# EAGLE design thermo_test (EAGLE 9.6.2)
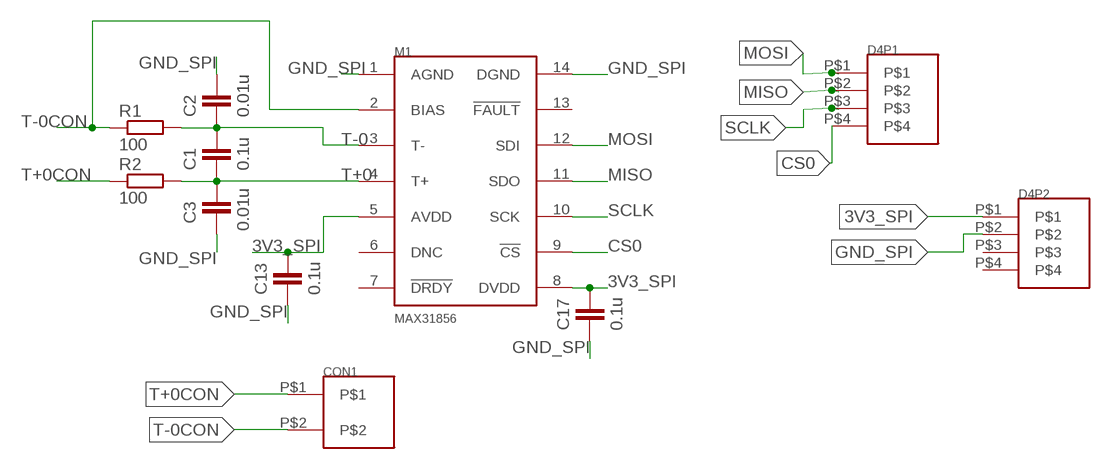
[diagram p0: schematic, sheet 1]

## Parts
C1  0.1u  C-EUC0603  [C0603]
C2  0.01u  C-EUC0603  [C0603]
C3  0.01u  C-EUC0603  [C0603]
C13  0.1u  C-EUC0603  [C0603]
C17  0.1u  C-EUC0603  [C0603]
CON1  893-1332  [893-1332]
D4P1  DF1E-4P  [DF1E-4P]
D4P2  DF1E-4P  [DF1E-4P]
M1  MAX31856  [TSSOP14]
R1  100  R-EU_R0603  [R0603]
R2  100  R-EU_R0603  [R0603]

## Nets
3V3_SPI [dev]: C13.1 C17.1 D4P2.P$1 M1.5(AVDD) M1.8(DVDD)
CS0 [dev]: D4P1.P$4 M1.9(!CS)
GND_SPI [dev]: C2.1 C3.2 C13.2 C17.2 D4P2.P$2 M1.1(AGND) M1.14(DGND)
MISO [spi_bus]: D4P1.P$2 M1.11(SDO)
MOSI [spi_bus]: D4P1.P$1 M1.12(SDI)
SCLK [spi_bus]: D4P1.P$3 M1.10(SCK)
T+0 [tc]: C1.2 C3.1 M1.4(T+) R2.2
T+0CON [tc]: CON1.P$1 R2.1
T-0 [tc]: C1.1 C2.2 M1.3(T-) R1.2
T-0CON [tc]: CON1.P$2 M1.2(BIAS) R1.1
Unconnected: D4P2.P$3 D4P2.P$4 M1.6(DNC) M1.7(!DRDY) M1.13(!FAULT)

## Library data of the parts
C1-C3 C13 C17 = rcl:C-EU: CAPACITOR, European symbol; SPICEPREFIX: C
CON1 = lib_test:893-1332
D4P1 D4P2 = lib_test:DF1E-4P
M1 = lib_test:MAX31856
R1 R2 = rcl:R-EU_: RESISTOR, European symbol; SPICEPREFIX: R

## Net classes
0 default: width 0.254 mm, drill 0.305 mm, clearance 0.254 mm
1 spi_bus: width 0.254 mm, drill 0.305 mm, clearance 0.254 mm
2 spi_cs: width 0.254 mm, drill 0.305 mm, clearance 0.254 mm
3 tc: width 0.254 mm, drill 0.305 mm, clearance 0.254 mm
4 3v3: width 0.508 mm, drill 0.61 mm, clearance 0.508 mm
5 gnd: width 0.762 mm, drill 0.889 mm, clearance 0.254 mm
6 dev: width 0.254 mm, drill 0.254 mm, clearance 0.254 mm

## Board
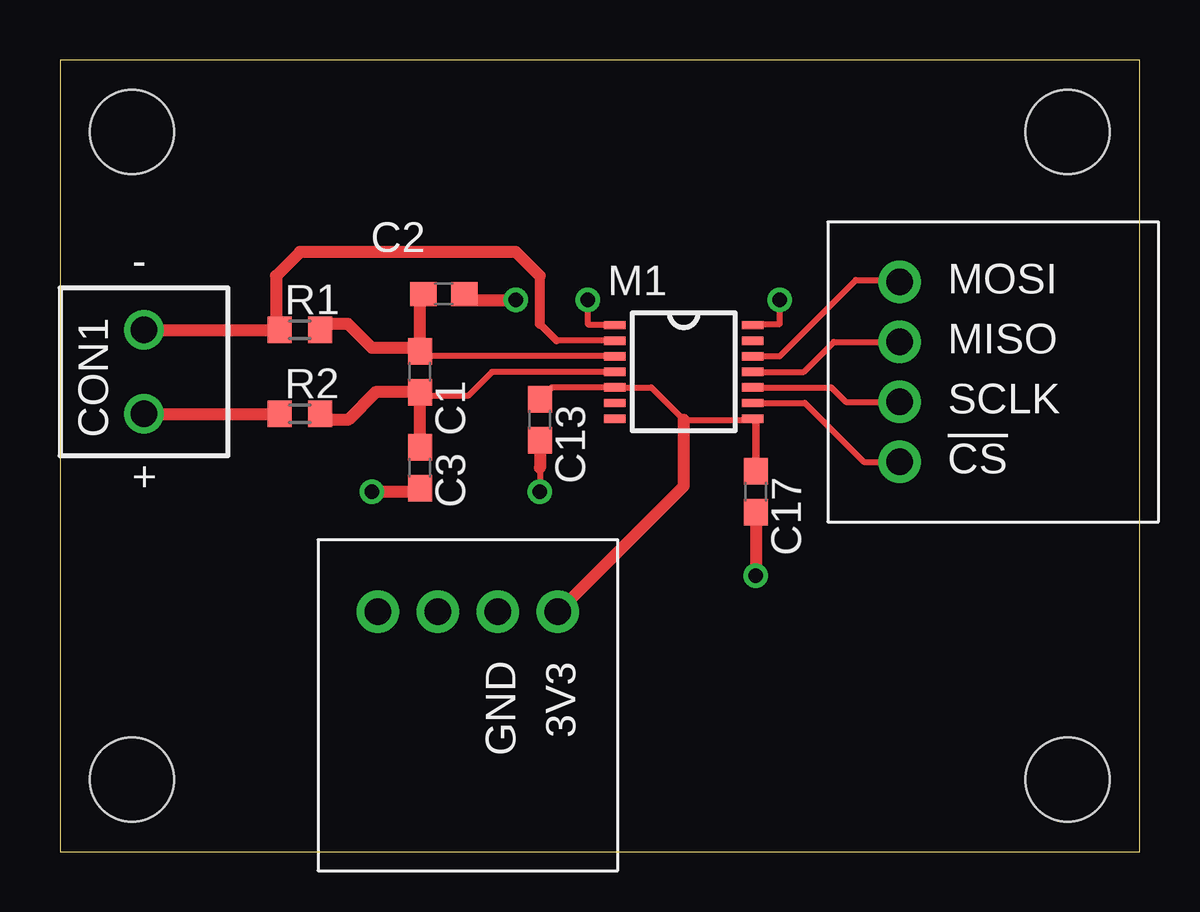
[diagram p1: board, top side]
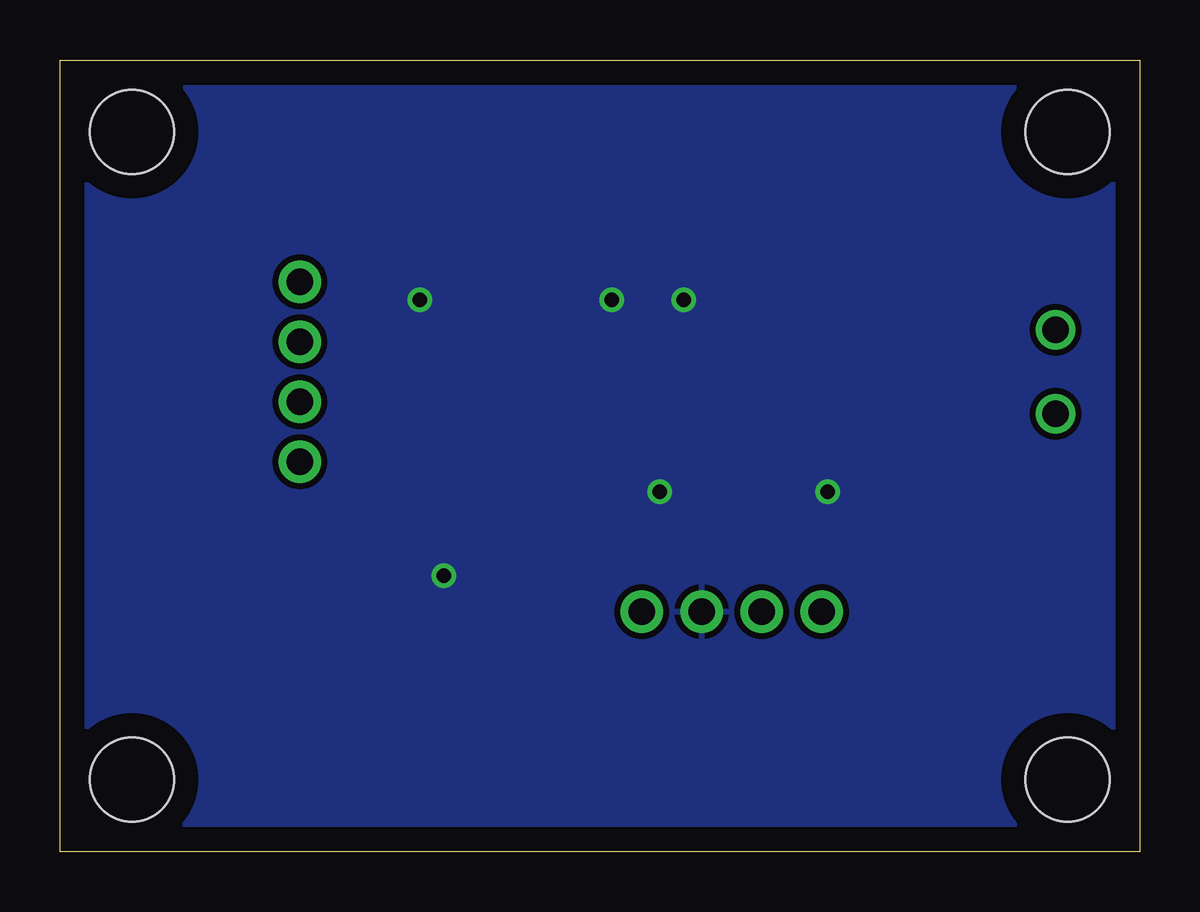
[diagram p2: board, bottom side, seen from below]

Size 45 x 33 mm. Coordinates in mm from the lower left corner, seen from the top.
Outline: 0,0 45,0 45,33 0,33 0,0
Copper layers (1*16): Top 0.035mm / dielectric 1.5mm / Bottom 0.035mm
Design rules "default": minimum track width 6mil, minimum drill 0.35mm, track to track 6mil, track to pad 6mil, pad to pad 6mil, via to via 6mil, smd to smd 6mil, copper to edge 40mil, drill to drill 6mil, minimum pad ring 10mil, minimum via ring 8mil, stop-mask expansion 4mil, vias tented up to drill 0mil, thermal gap 10mil
Holes 3.5 mm at 3,3 42,3 3,30 42,30

### Footprints (pad centres in the part's own frame; a part is rotated, then mirrored left to right if it is on the bottom)
C0603 = smd 1.1 x 1: 1 -0.85,0; 2 0.85,0
893-1332 = drill 1.1: P$1 0,1.75; P$2 0,-1.75
DF1E-4P = drill 1.1 pad 1.778: P$1 0,3.75; P$2 0,1.25; P$3 0,-1.25; P$4 0,-3.75
TSSOP14 = smd 0.9 x 0.35: 1 -2.875,1.95; 2 -2.875,1.3; 3 -2.875,0.65; 4 -2.875,0; 5 -2.875,-0.65; 6 -2.875,-1.3; 7 -2.875,-1.95; 8 2.875,-1.95; 9 2.875,-1.3; 10 2.875,-0.65; 11 2.875,0; 12 2.875,0.65; 13 2.875,1.3; 14 2.875,1.95
R0603 = smd 1 x 1.1: 1 -0.85,0; 2 0.85,0

### Placement (x,y rotation side)
C1  15,20 270 top
C2  16,23.25 180 top
C3  15,16 270 top
C13  20,18 270 top
C17  29,15 270 top
CON1  3.5,20 180 top
D4P1  35,20 0 top
D4P2  17,10 270 top
M1  26,20 0 top
R1  10,21.75 0 top
R2  10,18.25 0 top

### Tracks (layer width: path | path; a pad name or v marks a point on that pad's centre or on a via)
3V3_SPI
  Top 0.254: M1.8 28.82,18 26,18 24.65,19.35 M1.5 20.5,19.35 C13.1
  Top 0.305: M1.8 29,17.93 C17.1
  Top 0.508: D4P2.P$1 26,15.25 26,18
CS0
  Top 0.254: M1.9 31.05,18.7 33.5,16.25 D4P1.P$4
GND_SPI  (via drill 0.61)
  Top 0.254: 20,16 v20,15 | M1.1 22.05,21.95 22,22 v22,23 | M1.14 28.93,22 30,22 v30,23
  Top 0.508: C13.2 20,16 | C17.2 v29,11.5 | C2.1 17.1,23 v19,23 | C3.2 14.85,15 v13,15
  pour Bottom: 0,33 0,0 45,0 45,33
MISO
  Top 0.254: M1.11 31,20 32.25,21.25 D4P1.P$2
MOSI
  Top 0.254: M1.12 30,20.65 33.17,23.82 34.92,23.82 D4P1.P$1
SCLK
  Top 0.254: M1.10 32.15,19.35 32.75,18.75 D4P1.P$3
T+0
  Top 0.254: M1.4 18,20 17,19 15.15,19 | 15.15,19 C1.2 | 11.1,18 R2.2 | 15,18.85 15.15,19
  Top 0.508: C1.2 13.15,19.15 12,18 11.1,18 | C3.1 15,18.85
T+0CON
  Top 0.508: CON1.P$1 R2.1
T-0
  Top 0.254: M1.3 15.2,20.65 C1.1 14.85,21 | 15,23.1 C2.2 | 11.1,22 R1.2
  Top 0.508: C1.1 15,23.1 | 14.85,21 13,21 12,22 11.1,22
T-0CON
  Top 0.254: M1.2 20.7,21.3 | 9,21.9 R1.1
  Top 0.305: 20.7,21.3 20,22
  Top 0.406: 20,22 20,24
  Top 0.508: 20,24 19,25 10,25 9,24 9,21.9 | CON1.P$2 R1.1

### Text on the board
tPlace: MOSI | MISO | SCLK | !CS | 3V3 | GND
tNames: - | +